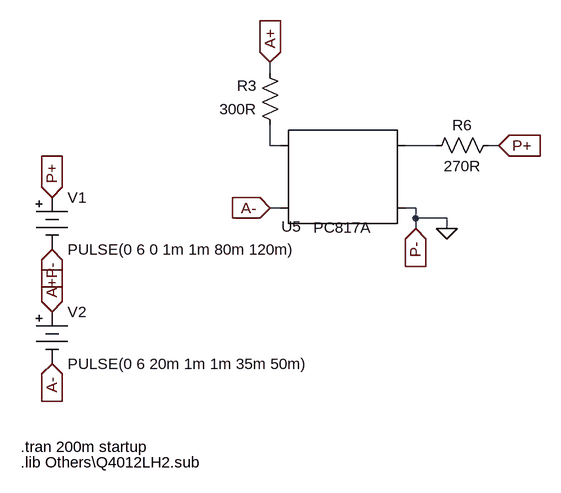
[diagram p0: schematic Static Transfer Using Triac with MOC3081 (teste parcial).asc]
Static Transfer Using Triac with MOC3081 (teste parcial).asc, the LTspice schematic file:
Version 4
SHEET 1 1152 744
WIRE -160 -128 -160 -144
WIRE -160 -16 -160 -48
WIRE -144 -16 -160 -16
WIRE 96 -16 48 -16
WIRE 192 -16 176 -16
WIRE -144 80 -160 80
WIRE 64 80 48 80
WIRE 64 96 64 80
WIRE 112 96 64 96
WIRE 64 112 64 96
WIRE 112 112 112 96
FLAG 192 -16 P+
IOPIN 192 -16 In
FLAG -160 80 A-
IOPIN -160 80 In
FLAG -160 -144 A+
IOPIN -160 -144 In
FLAG 64 112 P-
IOPIN 64 112 In
FLAG -496 64 P+
IOPIN -496 64 In
FLAG -496 144 P-
IOPIN -496 144 In
FLAG -496 240 A+
IOPIN -496 240 In
FLAG -496 320 A-
IOPIN -496 320 In
FLAG 112 112 0
SYMBOL Optos\\PC817A -48 32 R0
WINDOW 0 -79 77 Center 2
WINDOW 3 -1 78 Center 2
SYMATTR InstName U5
SYMBOL res -144 -32 R180
WINDOW 0 36 76 Left 2
WINDOW 3 36 40 Left 2
SYMATTR InstName R3
SYMATTR Value 300R
SYMBOL res 80 0 R270
WINDOW 0 32 56 VTop 2
WINDOW 3 0 56 VBottom 2
SYMATTR InstName R6
SYMATTR Value 270R
SYMBOL Misc\\battery -496 48 R0
WINDOW 123 0 0 Left 0
WINDOW 39 0 0 Left 0
SYMATTR InstName V1
SYMATTR Value PULSE(0 6 0 1m 1m 80m 120m)
SYMBOL Misc\\battery -496 224 R0
WINDOW 123 0 0 Left 0
WINDOW 39 0 0 Left 0
SYMATTR InstName V2
SYMATTR Value PULSE(0 6 20m 1m 1m 35m 50m)
TEXT -544 448 Left 2 !.tran 200m startup
TEXT -544 472 Left 2 !.lib Others\\Q4012LH2.sub

The netlist it stands for:
* Static Transfer Using Triac with MOC3081 (teste parcial).asc
XU5 N001 A- N002 0 PC817 Igain=1m
R3 N001 A+ 300R
R6 N002 P+ 270R
V1 P+ 0 PULSE(0 6 0 1m 1m 80m 120m)
V2 A+ A- PULSE(0 6 20m 1m 1m 35m 50m)
.tran 200m startup
.lib Others\Q4012LH2.sub
.lib PC817.sub
.backanno
.end